# EAGLE design solo-fp1020 (EAGLE 9.6.2)
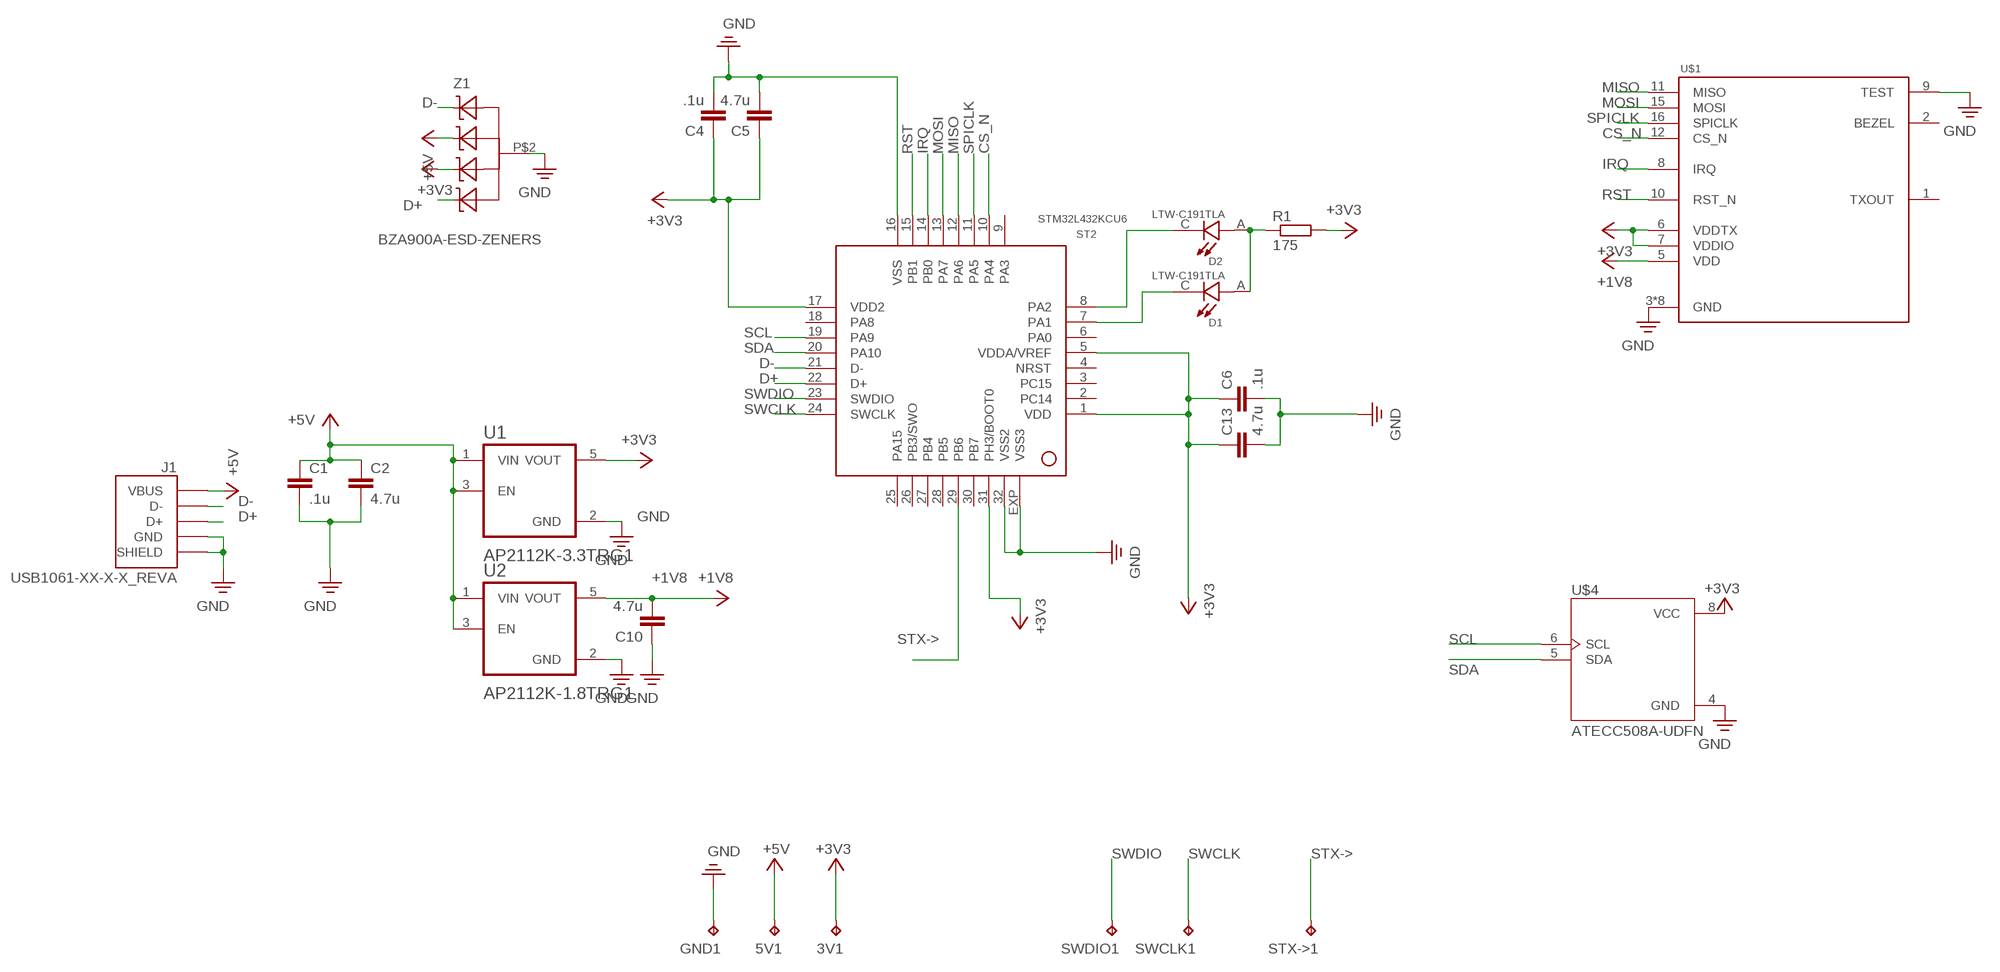
[diagram p0: schematic, sheet 1]

## Parts
3V1  TEST_POINT  [B1,27]
5V1  TEST_POINT  [B1,27]
C1  .1u  C-EUC0603  [C0603]
C2  4.7u  C-EUC0603  [C0603]
C4  .1u  C-EUC0603  [C0603]
C5  4.7u  C-EUC0603  [C0603]
C6  .1u  C-EUC0603  [C0603]
C10  4.7u  C-EUC0603  [C0603]
C13  4.7u  C-EUC0603  [C0603]
D1  LTW-C191TLA  [LEDC1608X65N]
D2  LTW-C191TLA  [LEDC1608X65N]
GND1  TEST_POINT  [B1,27]
J1  USB1061-XX-X-X_REVA  [GCT_USB1061-XX-X-X_REVA]
R1  175  R-EU_R0603  [R0603]
ST2  STM32L432KCU6  [QFN32]
STX->1  TEST_POINT  [B1,27]
SWCLK1  TEST_POINT  [B1,27]
SWDIO1  TEST_POINT  [B1,27]
U1  AP2112K-3.3TRG1  [SOT95P285X140-5N]
U2  AP2112K-1.8TRG1  AP2112K-3.3TRG1  [SOT95P285X140-5N]
U$1  FPC1020AM  [FPC1020AM]
U$4  ATECC508A-UDFN  [SON50P200X300X60-9N]
Z1  BZA900A-ESD-ZENERS  [BZA900A]

## Nets
+1V8 [power]: C10.2 U2.5(VOUT) U$1.5(VDD)
+3V3 [power]: 3V1.TP C4.1 C5.1 C6.1 C13.1 R1.2 ST2.1(VDD) ST2.5(VDDA/VREF) ST2.17(VDD2) ST2.31(PH3/BOOT0) U1.5(VOUT) U$1.6(VDDTX) U$1.7(VDDIO) U$4.8(VCC) Z1.P$5(C1)
+5V [power]: 5V1.TP C1.1 C2.1 J1.1(VBUS) U1.1(VIN) U1.3(EN) U2.1(VIN) U2.3(EN) Z1.P$1(C)
CS_N: ST2.10(PA4) U$1.12(CS_N)
D+: J1.3(D+) ST2.22(D+) Z1.P$3(C3)
D-: J1.2(D-) ST2.21(D-) Z1.P$4(C2)
GND [power]: C1.2 C2.2 C4.2 C5.2 C6.2 C10.1 C13.2 GND1.TP J1.4(GND) J1.5(SHIELD) J1.6(SHIELD) ST2.16(VSS) ST2.32(VSS2) ST2.EXP(VSS3) U1.2(GND) U2.2(GND) U$1.3(GND) U$1.4(GND) U$1.9(TEST) U$1.13(GND) U$1.14(GND) U$1.17(GND) U$1.18(GND) U$1.19(GND) U$1.20(GND) U$4.4(GND) Z1.P$2
IRQ: ST2.14(PB0) U$1.8(IRQ)
MISO: ST2.12(PA6) U$1.11(MISO)
MOSI: ST2.13(PA7) U$1.15(MOSI)
N$1: D1.A D2.A R1.1
N$10: D2.C ST2.8(PA2)
N$14: D1.C ST2.7(PA1)
RST: ST2.15(PB1) U$1.10(RST_N)
SCL: ST2.19(PA9) U$4.6(SCL)
SDA: ST2.20(PA10) U$4.5(SDA)
SPICLK: ST2.11(PA5) U$1.16(SPICLK)
STX->: ST2.29(PB6) STX->1.TP
SWCLK: ST2.24(SWCLK) SWCLK1.TP
SWDIO: ST2.23(SWDIO) SWDIO1.TP
Unconnected: ST2.2(PC14) ST2.3(PC15) ST2.4(NRST) ST2.6(PA0) ST2.9(PA3) ST2.18(PA8) ST2.25(PA15) ST2.26(PB3/SWO) ST2.27(PB4) ST2.28(PB5) ST2.30(PB7) U$1.1(TXOUT) U$1.2(BEZEL)

## Library data of the parts
3V1 5V1 GND1 STX->1 SWCLK1 SWDIO1 = efm-fido:TEST_POINT
C1 C2 C4-C6 C10 C13 = rcl:C-EU: CAPACITOR, European symbol; SPICEPREFIX: C
D1 D2 = LTW-C191TLA:LTW-C191TLA: CHIP LED WHITE 0603 TOP VIEW Check prices <https://pricing.snapeda.com/parts/LTW-C191TLA/Lite-On/view-part?ref=eda>; AVAILABILITY: In Stock; DESCRIPTION: White - LED Indication - Discrete 3.1V 0603 (1608 Metric); MF: Lite-On; MP: LTW-C191TLA; PACKAGE: 0603 Lite-On; PRICE: None; PURCHASE-URL: https://pricing.snapeda.com/search/part/LTW-C191TLA/?ref=eda
J1 = USB1061-XX-X-X_REVA:USB1061-XX-X-X_REVA: USB Plug, Type A, 4 Pin, Mid Miunt, Offset 1.43mm, SMT, Horizontal, Top Mount, Plastic Peg & Kinked Shelll Stakes Check prices <https://pricing.snapeda.com/parts/USB1061-GF-L-A/Global%20Connector%20Technology/view-part?ref=eda>; AVAILABILITY: In Stock; DESCRIPTION: USB-A (USB TYPE-A) USB 2.0 Plug Connector 4 Position Board Edge, Cutout; Surface Mount; Through Hole, Right Angle; MF: Global Connector Technology; MP: USB1061-GF-L-A; PACKAGE: None; PRICE: None; PURCHASE-URL: https://pricing.snapeda.com/search/part/USB1061-GF-L-A/?ref=eda
R1 = rcl:R-EU_: RESISTOR, European symbol; SPICEPREFIX: R
ST2 = efm-fido:STM32L432KCU6
U1 U2 = AP2112K-3.3TRG1:AP2112K-3.3TRG1: AP2112 Series 0.6 A 3.3 V Fixed Output SMT LDO Linear Regulator - SOT23-5; AVAILABILITY: Unavailable; DESCRIPTION: AP2112 Series 0.6 A 3.3 V Fixed Output SMT LDO Linear Regulator - SOT23-5; MF: Diodes Inc.; MP: AP2112K-3.3TRG1; PACKAGE: SOT-753 Diodes Inc.; PRICE: None
U$1 = FPC1020:FPC1020AM: FPC1020AM Fingerprint Sensor flexible cable Connector: Hirose Part Number: BM10NB(0.8)-16DS-0.4V(51)
U$4 = ATECC508A:ATECC508A
Z1 = efm-fido:BZA900A-ESD-ZENERS

## Net classes
0 default: width 0.15 mm, drill 0.2 mm, clearance 0.1 mm
1 power: width 0.25 mm, drill 0.2 mm, clearance 0.15 mm

## Board
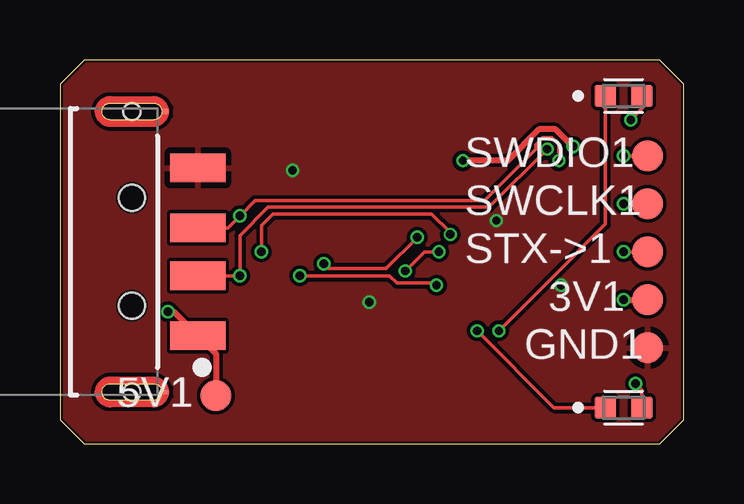
[diagram p1: board, top side]
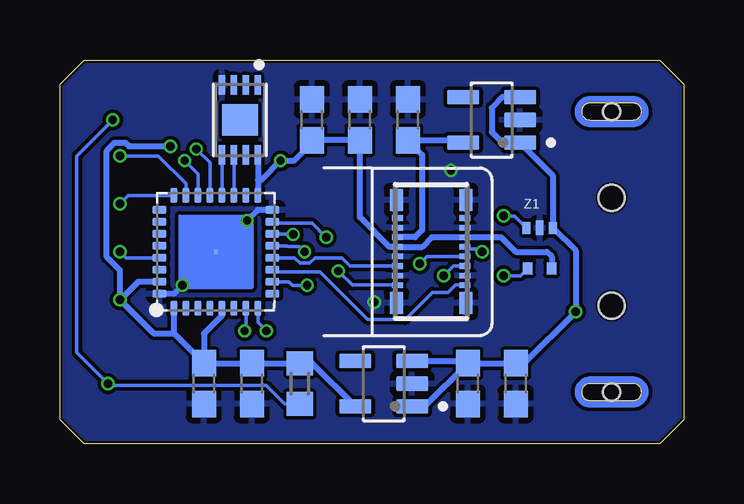
[diagram p2: board, bottom side, seen from below]

Size 26 x 16 mm. Coordinates in mm from the lower left corner, seen from the top.
Outline: 1,0 25,0 26,1 26,15 25,16 1,16 0,15 0,1 1,0
Copper layers (1*16): Top 0.035559375mm / dielectric 1.2mm / Bottom 0.035559375mm
Design rules "jlcpcb-4-layer *": minimum track width 5mil, minimum drill 0.2mm, track to track 0.126490625mm, track to pad 0.126490625mm, pad to pad 0.126490625mm, via to via 0.126490625mm, smd to smd 0mil, copper to edge 0.1mm, drill to drill 5mil, minimum pad ring 4mil, minimum via ring 4mil, stop-mask expansion 3mil, vias tented up to drill 100mil, thermal gap 10mil

### Footprints (pad centres in the part's own frame; a part is rotated, then mirrored left to right if it is on the bottom)
B1,27 = smd 1.27 x 1.27: TP 0,0
C0603 = smd 1.1 x 1: 1 -0.85,0; 2 0.85,0
LEDC1608X65N = smd 0.91 x 0.93: A 0.76,0; C -0.76,0
GCT_USB1061-XX-X-X_REVA = smd 1.2 x 2.3: 1 3.5,2.75; 2 1,2.75; 3 -1,2.75; 4 -3.5,2.75 | smd 0.2 x 0.2: 5 -5.85,1.4; 6 5.85,1.4 | hole 1.1: -2.25,0; 2.25,0 | hole 0.7: -5.85,0; 5.85,0
R0603 = smd 1 x 1.1: 1 -0.85,0; 2 0.85,0
QFN32 = smd 0.6 x 0.3: 1 -2.35,1.75; 2 -2.35,1.25; 3 -2.35,0.75; 4 -2.35,0.25; 5 -2.35,-0.25; 6 -2.35,-0.75; 7 -2.35,-1.25; 8 -2.35,-1.75; 17 2.35,-1.75; 18 2.35,-1.25; 19 2.35,-0.75; 20 2.35,-0.25; 21 2.35,0.25; 22 2.35,0.75; 23 2.35,1.25; 24 2.35,1.75 | smd 0.3 x 0.6: 9 -1.75,-2.35; 10 -1.25,-2.35; 11 -0.75,-2.35; 12 -0.25,-2.35; 13 0.25,-2.35; 14 0.75,-2.35; 15 1.25,-2.35; 16 1.75,-2.35; 25 1.75,2.35; 26 1.25,2.35; 27 0.75,2.35; 28 0.25,2.35; 29 -0.25,2.35; 30 -0.75,2.35; 31 -1.25,2.35; 32 -1.75,2.35 | smd 0.2 x 0.2: EXP 0,0
SOT95P285X140-5N = smd 1.35 x 0.6: 1 -1.185,0.95; 2 -1.185,0; 3 -1.185,-0.95; 4 1.185,-0.95; 5 1.185,0.95
FPC1020AM = smd 0.23 x 0.47: 1 2.094,-3.929; 2 2.094,-1.119; 3 2.494,-3.929; 4 2.494,-1.119; 5 2.894,-3.929; 6 2.894,-1.119; 7 3.294,-3.929; 8 3.294,-1.119; 9 3.694,-3.929; 10 3.694,-1.119; 11 4.094,-3.929; 12 4.094,-1.119; 13 4.494,-3.929; 14 4.494,-1.119; 15 4.894,-3.929; 16 4.894,-1.119 | smd 0.92 x 0.55: 17 1.344,-1.079; 18 1.344,-3.969; 19 5.644,-3.969; 20 5.644,-1.079
SON50P200X300X60-9N = smd 0.81 x 0.26: 1 -1.45,0.75; 2 -1.45,0.25; 3 -1.45,-0.25; 4 -1.45,-0.75; 5 1.45,-0.75; 6 1.45,-0.25; 7 1.45,0.25; 8 1.45,0.75 | smd 1.3 x 1.5: 9 0,0
BZA900A = smd 0.325 x 0.5: P$1 -0.05,0; P$3 1.05,0 | smd 0.3 x 0.6: P$2 0.5,0 | smd 0.4 x 0.5: P$4 1,1.7; P$5 0,1.7

### Placement (x,y rotation side)
3V1  24.5,6 0 top
5V1  6.5,2 0 top
C1  9,2.5 270 bottom
C2  7,2.5 270 bottom
C4  15.5,13.5 90 bottom
C5  13.5,13.5 90 bottom
C6  18,2.5 270 bottom
C10  11.5,13.5 270 bottom
C13  20,2.5 270 bottom
D1  23.5,14.5 0 top
D2  23.5,1.5 0 top
GND1  24.5,4 0 top
J1  3,8 270 top
R1  16,2.5 90 bottom
ST2  19.5,8 90 bottom
STX->1  24.5,8 0 top
SWCLK1  24.5,10 0 top
SWDIO1  24.5,12 0 top
U1  12.5,2.5 180 bottom
U2  8,13.5 180 bottom
U$1  8,11.5 270 bottom
U$4  18.5,13.5 270 bottom
Z1  5.5,9 180 bottom

### Tracks (layer width: path | path; a pad name or v marks a point on that pad's centre or on a via)
+1V8
  Bottom 0.25: U2.5 9.29,12.65 C10.2 10.9,12.05 10.9,8.9 11.19,8.61 U$1.5
+3V3  (via drill 0.35)
  Top 0.25: v23.5,6 3V1.TP | v21.4,12.4 21.37,12.4 20.66,13.11 19.98,13.11 18.67,11.8 v16.8,11.8
  Bottom 0.25: C13.1 C6.1 R1.2 15.48,3.35 U1.5 | ST2.31 22.75,6.75 v23.5,6 | C13.1 21.25,4.6 | 21.25,4.6 ST2.1 | Z1.P$5 5.5,7.8 5.7,8 7,8 7.61,8.61 U$1.6 10.49,8.61 10.89,8.21 U$1.7 12.27,8.21 13.5,9.44 C5.1 15.4,12.65 | 15.4,12.65 C4.1 | U$4.8 17.75,11 | 17.75,11 ST2.17 | ST2.5 19.23,5.62 19.23,5.36 20,4.59 C13.1 | v23.5,6 22.1,4.6 21.25,4.6 | v23.5,6 23.5,7.22 24.05,7.77 24.05,12.23 23.73,12.55 23.27,12.55 23.12,12.4 v21.4,12.4 | 15.4,12.65 16.25,11.8 v16.8,11.8 17.6,11 17.75,11
+5V  (via drill 0.35)
  Top 0.25: v4.5,5.5 4.75,5.5 J1.1 6.5,3.75 5V1.TP
  Bottom 0.25: U1.3 9.1,3.45 C1.1 | C1.1 C2.1 6.65,3.35 v4.5,5.5 4.5,8.05 Z1.P$1 5.45,11.19 U2.1 6.87,12.5 7.5,12.5 8,13 8,14 7.55,14.45 U2.3 | C1.1 10.8,1.55 U1.1
CS_N  (via drill 0.35)
  Top 0.15: v10,7 13.74,7 14.05,6.69 15.61,6.69 v15.7,6.6
  Bottom 0.15: U$1.12 9.59,7.41 v10,7 | ST2.10 16.45,6.75 16.3,6.6 v15.7,6.6
D+  (via drill 0.35)
  Top 0.15: J1.3 7,9 v7.5,9.5 8.13,10.13 17.7,10.13 19.84,12.27 19.84,12.48 20.12,12.76 20.52,12.76 20.8,12.48 v20.8,11.8
  Bottom 0.15: Z1.P$3 7.05,9.5 v7.5,9.5 | ST2.22 20.25,11.25 v20.8,11.8
D-  (via drill 0.35)
  Top 0.15: J1.2 v7.5,7 7.5,8.68 8.68,9.86 17.89,9.86 v20.32,12.28
  Bottom 0.15: Z1.P$4 6.8,7 v7.5,7 | ST2.21 19.75,11.71 v20.32,12.28
GND  (via drill 0.35)
  Bottom 0.25: ST2.32 21.25,6.25 v20.9,6.6 ST2.EXP v18.2,9.3 17.75,9.75 ST2.16
  other vias: 9.7,11.4 12.9,5.9
  pour Bottom: 26,0 26,16 0,16 0,0
  pour Top: 26,16 26,0 0,0 0,16
IRQ  (via drill 0.35)
  Top 0.15: v8.4,8 8.4,9.1 8.88,9.58 15.5,9.58 16.28,8.8 v16.28,8.72
  Bottom 0.15: U$1.8 9.04,8.12 8.6,8.12 8.48,8 v8.4,8 | ST2.14 16.31,8.75 v16.28,8.72
MISO
  Bottom 0.15: U$1.11 13.91,7.41 14.25,7.75 15.37,7.75 15.6,7.52 16,7.52 16.23,7.75 ST2.12
MOSI  (via drill 0.35)
  Top 0.15: v14.4,7.2 15.2,8 v15.8,8
  Bottom 0.15: U$1.15 13.81,6.61 v14.4,7.2 | ST2.13 16.53,8.25 16.5,8.22 16.02,8.22 v15.8,8
N$1  (via drill 0.35)
  Top 0.15: D1.A 24.26,13.96 v23.8,13.5 | v24,2.5 24.26,2.24 D2.A
  Bottom 0.15: v23.8,13.5 25.3,12 25.3,3.8 v24,2.5 23.93,2.42 17.41,2.42 16.63,1.65 R1.1
N$10  (via drill 0.35)
  Top 0.15: v17.4,4.7 20.6,1.5 D2.C
  Bottom 0.15: ST2.8 17.75,5.05 v17.4,4.7
N$14  (via drill 0.35)
  Top 0.15: v18.3,4.7 20.4,6.8 20.4,6.81 22.74,9.15 D1.C
  Bottom 0.15: ST2.7 18.25,4.85 18.2,4.8 v18.3,4.7
RST  (via drill 0.35)
  Top 0.15: v11,7.5 11.2,7.3 13.6,7.3 v14.9,8.6
  Bottom 0.15: U$1.10 10.69,7.81 v11,7.5 | v14.9,8.6 15.5,9.2 17.1,9.2 ST2.15
SCL
  Bottom 0.15: U$4.6 ST2.19
SDA
  Bottom 0.15: U$4.5 ST2.20
SPICLK
  Bottom 0.15: U$1.16 9.52,6.61 9.82,6.31 10.47,6.31 11.6,5.17 13.17,5.17 15.15,7.15 17.05,7.15 ST2.11
STX->  (via drill 0.35)
  Top 0.15: v23.5,8 STX->1.TP
  Bottom 0.15: ST2.29 23.25,7.75 v23.5,8
SWCLK  (via drill 0.35)
  Top 0.15: v23.5,10 SWCLK1.TP
  Bottom 0.15: ST2.24 23.15,10.35 v23.5,10
SWDIO  (via drill 0.35)
  Top 0.15: v23.5,12 SWDIO1.TP
  Bottom 0.15: ST2.23 20.75,10.85 21.9,12 v23.5,12